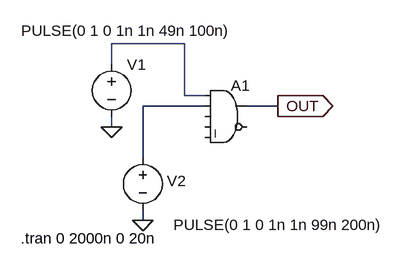
[diagram p0: schematic and_gate.asc]
and_gate.asc, the LTspice schematic file:
Version 4
SHEET 1 880 680
WIRE 176 32 64 32
WIRE 64 64 64 32
WIRE 176 112 176 32
WIRE 208 112 176 112
WIRE 208 128 112 128
WIRE 320 128 272 128
WIRE 64 160 64 144
WIRE 112 208 112 128
WIRE 112 304 112 288
FLAG 112 304 0
FLAG 64 160 0
FLAG 320 128 OUT
IOPIN 320 128 Out
SYMBOL Digital\\and 240 80 R0
SYMATTR InstName A1
SYMBOL voltage 64 48 R0
WINDOW 3 -139 -36 Left 2
WINDOW 123 0 0 Left 0
WINDOW 39 0 0 Left 0
SYMATTR InstName V1
SYMATTR Value PULSE(0 1 0 1n 1n 49n 100n)
SYMBOL voltage 112 192 R0
WINDOW 0 37 51 Left 2
WINDOW 3 47 119 Left 2
WINDOW 123 0 0 Left 0
WINDOW 39 0 0 Left 0
SYMATTR InstName V2
SYMATTR Value PULSE(0 1 0 1n 1n 99n 200n)
TEXT -76 332 Left 2 !.tran 0 2000n 0 20n

The netlist it stands for:
* and_gate.asc
A1 N001 N002 0 0 0 0 OUT 0 AND
V1 N001 0 PULSE(0 1 0 1n 1n 49n 100n)
V2 N002 0 PULSE(0 1 0 1n 1n 99n 200n)
.tran 0 2000n 0 20n
.backanno
.end